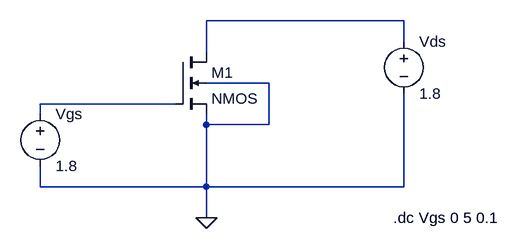
[diagram p0: schematic nmos_characteristics.asc]
nmos_characteristics.asc, the LTspice schematic file:
Version 4
SHEET 1 880 680
WIRE 480 80 176 80
WIRE 480 112 480 80
WIRE 176 128 176 80
WIRE 272 176 176 176
WIRE 128 208 -80 208
WIRE -80 224 -80 208
WIRE 176 240 176 224
WIRE 272 240 272 176
WIRE 272 240 176 240
WIRE -80 336 -80 304
WIRE 176 336 176 240
WIRE 176 336 -80 336
WIRE 480 336 480 192
WIRE 480 336 176 336
WIRE 176 384 176 336
FLAG 176 384 0
SYMBOL nmos4 128 128 R0
SYMATTR InstName M1
SYMATTR Value2 l=80n w=80n
SYMBOL voltage -80 208 R0
WINDOW 123 0 0 Left 0
WINDOW 39 0 0 Left 0
SYMATTR InstName Vgs
SYMATTR Value 1.8
SYMBOL voltage 480 96 R0
WINDOW 123 0 0 Left 0
WINDOW 39 0 0 Left 0
SYMATTR InstName Vds
SYMATTR Value 1.8
TEXT 464 384 Left 2 !.dc Vgs 0 5 0.1

The netlist it stands for:
* nmos_characteristics.asc
M1 N001 N002 0 0 NMOS l=80n w=80n
Vgs N002 0 1.8
Vds N001 0 1.8
.model NMOS NMOS
.model PMOS PMOS
.lib standard.mos
.dc Vgs 0 5 0.1
.backanno
.end